# EAGLE design CharlieplexedPairReactorBreakout (EAGLE 6.5.0)
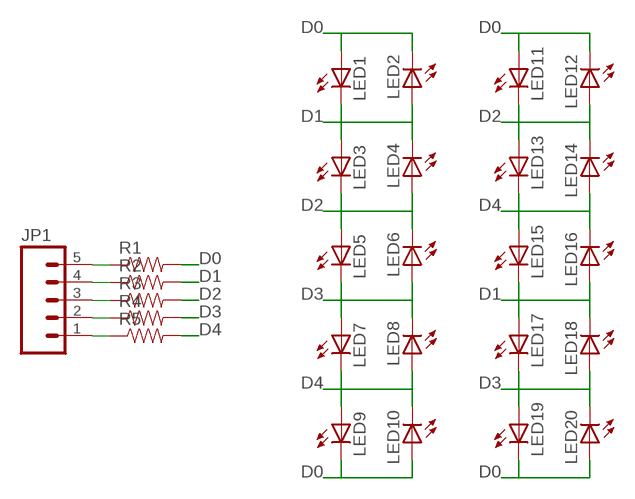
[diagram p0: schematic, sheet 1]

## Parts
JP1  M05PTH  [1X05]
LED1  LEDOVAL  [LED-OVAL]
LED2  LEDOVAL  [LED-OVAL]
LED3  LEDOVAL  [LED-OVAL]
LED4  LEDOVAL  [LED-OVAL]
LED5  LEDOVAL  [LED-OVAL]
LED6  LEDOVAL  [LED-OVAL]
LED7  LEDOVAL  [LED-OVAL]
LED8  LEDOVAL  [LED-OVAL]
LED9  LEDOVAL  [LED-OVAL]
LED10  LEDOVAL  [LED-OVAL]
LED11  LEDOVAL  [LED-OVAL]
LED12  LEDOVAL  [LED-OVAL]
LED13  LEDOVAL  [LED-OVAL]
LED14  LEDOVAL  [LED-OVAL]
LED15  LEDOVAL  [LED-OVAL]
LED16  LEDOVAL  [LED-OVAL]
LED17  LEDOVAL  [LED-OVAL]
LED18  LEDOVAL  [LED-OVAL]
LED19  LEDOVAL  [LED-OVAL]
LED20  LEDOVAL  [LED-OVAL]
R1  RESISTORAXIAL-0.3  [AXIAL-0.3]
R2  RESISTORAXIAL-0.3  [AXIAL-0.3]
R3  RESISTORAXIAL-0.3  [AXIAL-0.3]
R4  RESISTORAXIAL-0.3  [AXIAL-0.3]
R5  RESISTORAXIAL-0.3  [AXIAL-0.3]

## Nets
D0: LED1.ANODE(A) LED2.CATHODE(C) LED9.CATHODE(C) LED10.ANODE(A) LED11.ANODE(A) LED12.CATHODE(C) LED19.CATHODE(C) LED20.ANODE(A) R1.P$2
D1: LED1.CATHODE(C) LED2.ANODE(A) LED3.ANODE(A) LED4.CATHODE(C) LED15.CATHODE(C) LED16.ANODE(A) LED17.ANODE(A) LED18.CATHODE(C) R2.P$2
D2: LED3.CATHODE(C) LED4.ANODE(A) LED5.ANODE(A) LED6.CATHODE(C) LED11.CATHODE(C) LED12.ANODE(A) LED13.ANODE(A) LED14.CATHODE(C) R3.P$2
D3: LED5.CATHODE(C) LED6.ANODE(A) LED7.ANODE(A) LED8.CATHODE(C) LED17.CATHODE(C) LED18.ANODE(A) LED19.ANODE(A) LED20.CATHODE(C) R4.P$2
D4: LED7.CATHODE(C) LED8.ANODE(A) LED9.ANODE(A) LED10.CATHODE(C) LED13.CATHODE(C) LED14.ANODE(A) LED15.ANODE(A) LED16.CATHODE(C) R5.P$2
MISO: JP1.4 R2.P$1
MOSI: JP1.5 R1.P$1
PB3: JP1.2 R4.P$1
PB4: JP1.1 R5.P$1
SCK: JP1.3 R3.P$1

## Library data of the parts
JP1 = SparkFun-Connectors:M05: Header 5 Standard 5-pin 0.1" header. Use with straight break away headers (SKU : PRT-00116), right angle break away headers (PRT-00553), swiss pins (PRT-00743), machine pins (PRT-00117), and female headers (PRT-00115). Molex polarized connector foot print use with SKU : PRT-08230 with associated crimp pins and housings.
LED1-LED20 = barbary_enterprises:LED: LEDs Standard schematic elements and footprints for 5mm, 3mm, 1206, and 0603 sized LEDs. 5mm - Spark Fun Electronics SKU : COM-00529 (and others)
R1-R5 = barbary_enterprises:RESISTOR: Resistor Basic schematic elements and footprints for 0603, 1206, and PTH resistors.

## Board
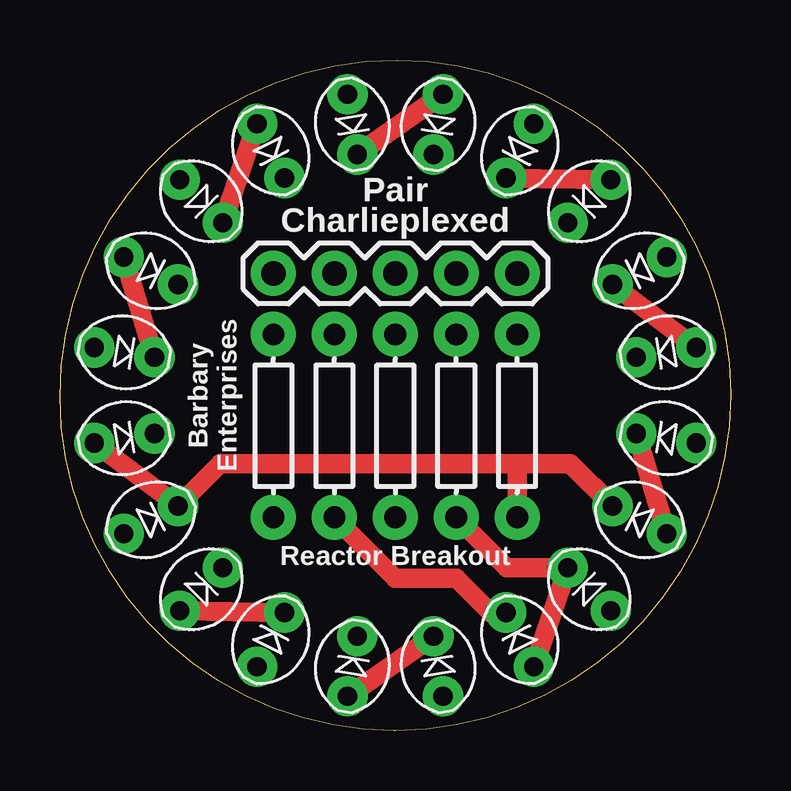
[diagram p1: board, top side]
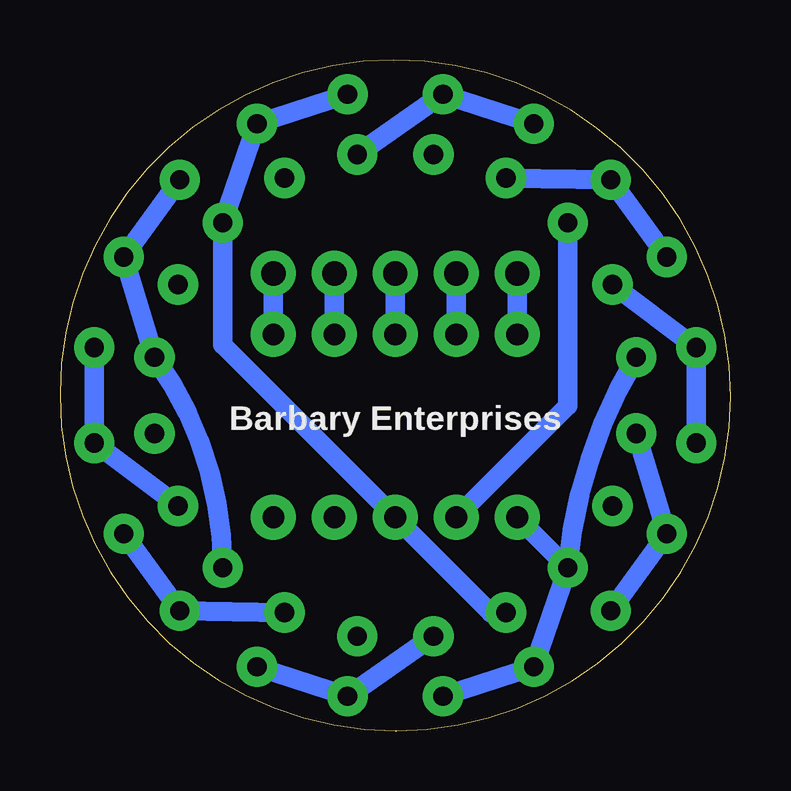
[diagram p2: board, bottom side, seen from below]

Size 27.94 x 27.94 mm. Coordinates in mm from the lower left corner, seen from the top.
Outline: 14.03,27.94 arc-90 27.94,14.03 27.94,13.97 arc-90 13.97,0 13.91,0 arc-90 0,13.91 arc-90 14.03,27.94
Copper layers (1*16): Top 0.0356mm / dielectric 1.5011mm / Bottom 0.0356mm
Design rules "LaenPCBOrder": minimum track width 6mil, minimum drill 13mil, track to track 6mil, track to pad 6mil, pad to pad 6mil, via to via 6mil, smd to smd 6mil, copper to edge 15mil, drill to drill 6mil, minimum pad ring 7mil, minimum via ring 7mil, stop-mask expansion 3mil, vias tented up to drill 0mil, thermal gap 10mil

### Footprints (pad centres in the part's own frame; a part is rotated, then mirrored left to right if it is on the bottom)
1X05 = drill 1.016 pad 1.88: 1 0,0; 2 2.54,0; 3 5.08,0; 4 7.62,0; 5 10.16,0
LED-OVAL = drill 0.8 pad 1.676: ANODE 1.27,0; CATHODE -1.27,0
AXIAL-0.3 = drill 0.9 pad 1.88: P$1 -3.81,0; P$2 3.81,0

### Placement (x,y rotation side)
JP1  8.89,19.05 0 top
LED1  25.26,15.76 9 top
LED2  24.15,19.16 27 top
LED3  22.05,22.05 45 top
LED4  19.16,24.15 63 top
LED5  15.76,25.26 81 top
LED6  12.18,25.26 99 top
LED7  8.78,24.15 117 top
LED8  5.89,22.05 135 top
LED9  3.79,19.16 153 top
LED10  2.68,15.76 171 top
LED11  2.68,12.18 189 top
LED12  3.79,8.78 207 top
LED13  5.89,5.89 225 top
LED14  8.78,3.79 243 top
LED15  12.18,2.68 261 top
LED16  15.76,2.68 279 top
LED17  19.16,3.79 297 top
LED18  22.05,5.89 315 top
LED19  24.15,8.78 333 top
LED20  25.26,12.18 351 top
R1  19.05,12.7 270 top
R2  16.51,12.7 270 top
R3  13.97,12.7 270 top
R4  11.43,12.7 270 top
R5  8.89,12.7 270 top

### Tracks (layer width: path | path; a pad name or v marks a point on that pad's centre or on a via)
D0
  Top 0.813: LED1.ANODE LED2.CATHODE | LED11.ANODE LED12.CATHODE 6.67,11.11 19.05,11.11 | 19.05,11.11 21.27,11.11 LED19.CATHODE | R1.P$2 19.05,11.11
  Bottom 0.813: LED11.ANODE LED10.ANODE LED9.CATHODE | LED19.CATHODE LED20.ANODE LED1.ANODE
D1
  Top 0.813: LED3.ANODE LED4.CATHODE | LED17.ANODE LED18.CATHODE 18.61,6.79 R2.P$2
  Bottom 0.813: LED3.ANODE LED2.ANODE LED1.CATHODE arc35 LED18.CATHODE | LED17.ANODE LED16.ANODE LED15.CATHODE
D2
  Top 0.813: LED5.ANODE LED6.CATHODE | LED13.ANODE LED14.CATHODE
  Bottom 0.813: LED5.ANODE LED4.ANODE LED3.CATHODE 21.15,16.07 R3.P$2 10,4.92 LED14.CATHODE | LED13.ANODE LED12.ANODE LED11.CATHODE
D3
  Top 0.813: LED7.ANODE LED8.CATHODE | LED19.ANODE LED20.CATHODE | LED17.CATHODE 17.94,4.92 16.51,6.35 13.97,6.35 R4.P$2
  Bottom 0.813: LED19.ANODE LED18.ANODE LED17.CATHODE | LED5.CATHODE LED6.ANODE LED7.ANODE | LED8.CATHODE 6.79,13.53 R4.P$2
D4
  Top 0.813: LED15.ANODE LED16.CATHODE | LED10.CATHODE LED9.ANODE
  Bottom 0.813: LED9.ANODE LED8.ANODE LED7.CATHODE | LED15.ANODE LED14.ANODE LED13.CATHODE | LED10.CATHODE arc-26 LED13.CATHODE | R5.P$2 LED13.CATHODE
MISO
  Bottom 0.813: R2.P$1 JP1.4
MOSI
  Bottom 0.813: R1.P$1 JP1.5
PB3
  Bottom 0.813: R4.P$1 JP1.2
PB4
  Bottom 0.813: R5.P$1 JP1.1
SCK
  Bottom 0.813: R3.P$1 JP1.3

### Text on the board
tPlace: Pair | Charlieplexed | Barbary / Enterprises | Reactor Breakout
bPlace: Barbary Enterprises